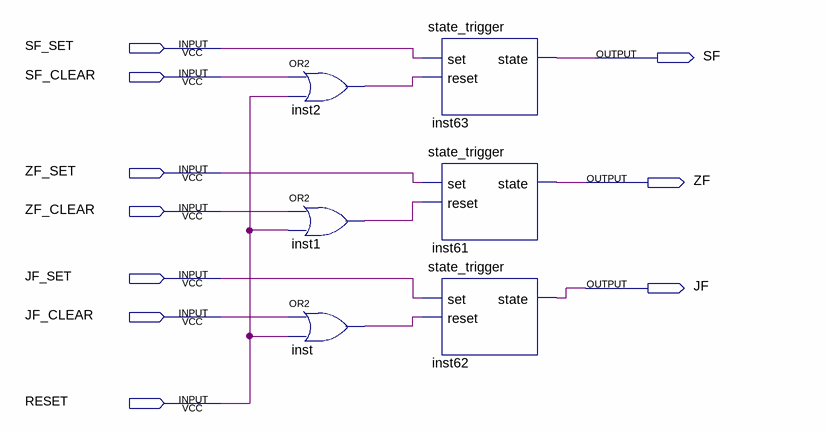
[diagram p0: schematic sheet]
// Quartus schematic flags.bdf as structural Verilog: 6 symbols, 10 pins
module flags (
  input  SF_SET,
  input  SF_CLEAR,
  input  ZF_SET,
  input  ZF_CLEAR,
  input  JF_SET,
  input  JF_CLEAR,
  input  RESET,
  output SF,
  output ZF,
  output JF
);

  wire inst1_out, inst2_out, inst_out;

  or inst2 (inst2_out, SF_CLEAR, RESET);
  or inst1 (inst1_out, ZF_CLEAR, RESET);
  or inst (inst_out, JF_CLEAR, RESET);
  state_trigger inst63 (.set(SF_SET), .reset(inst2_out), .state(SF));
  state_trigger inst61 (.set(ZF_SET), .reset(inst1_out), .state(ZF));
  state_trigger inst62 (.set(JF_SET), .reset(inst_out), .state(JF));
endmodule
